# EAGLE schematic Backplane_Reference (EAGLE 6.6.0)
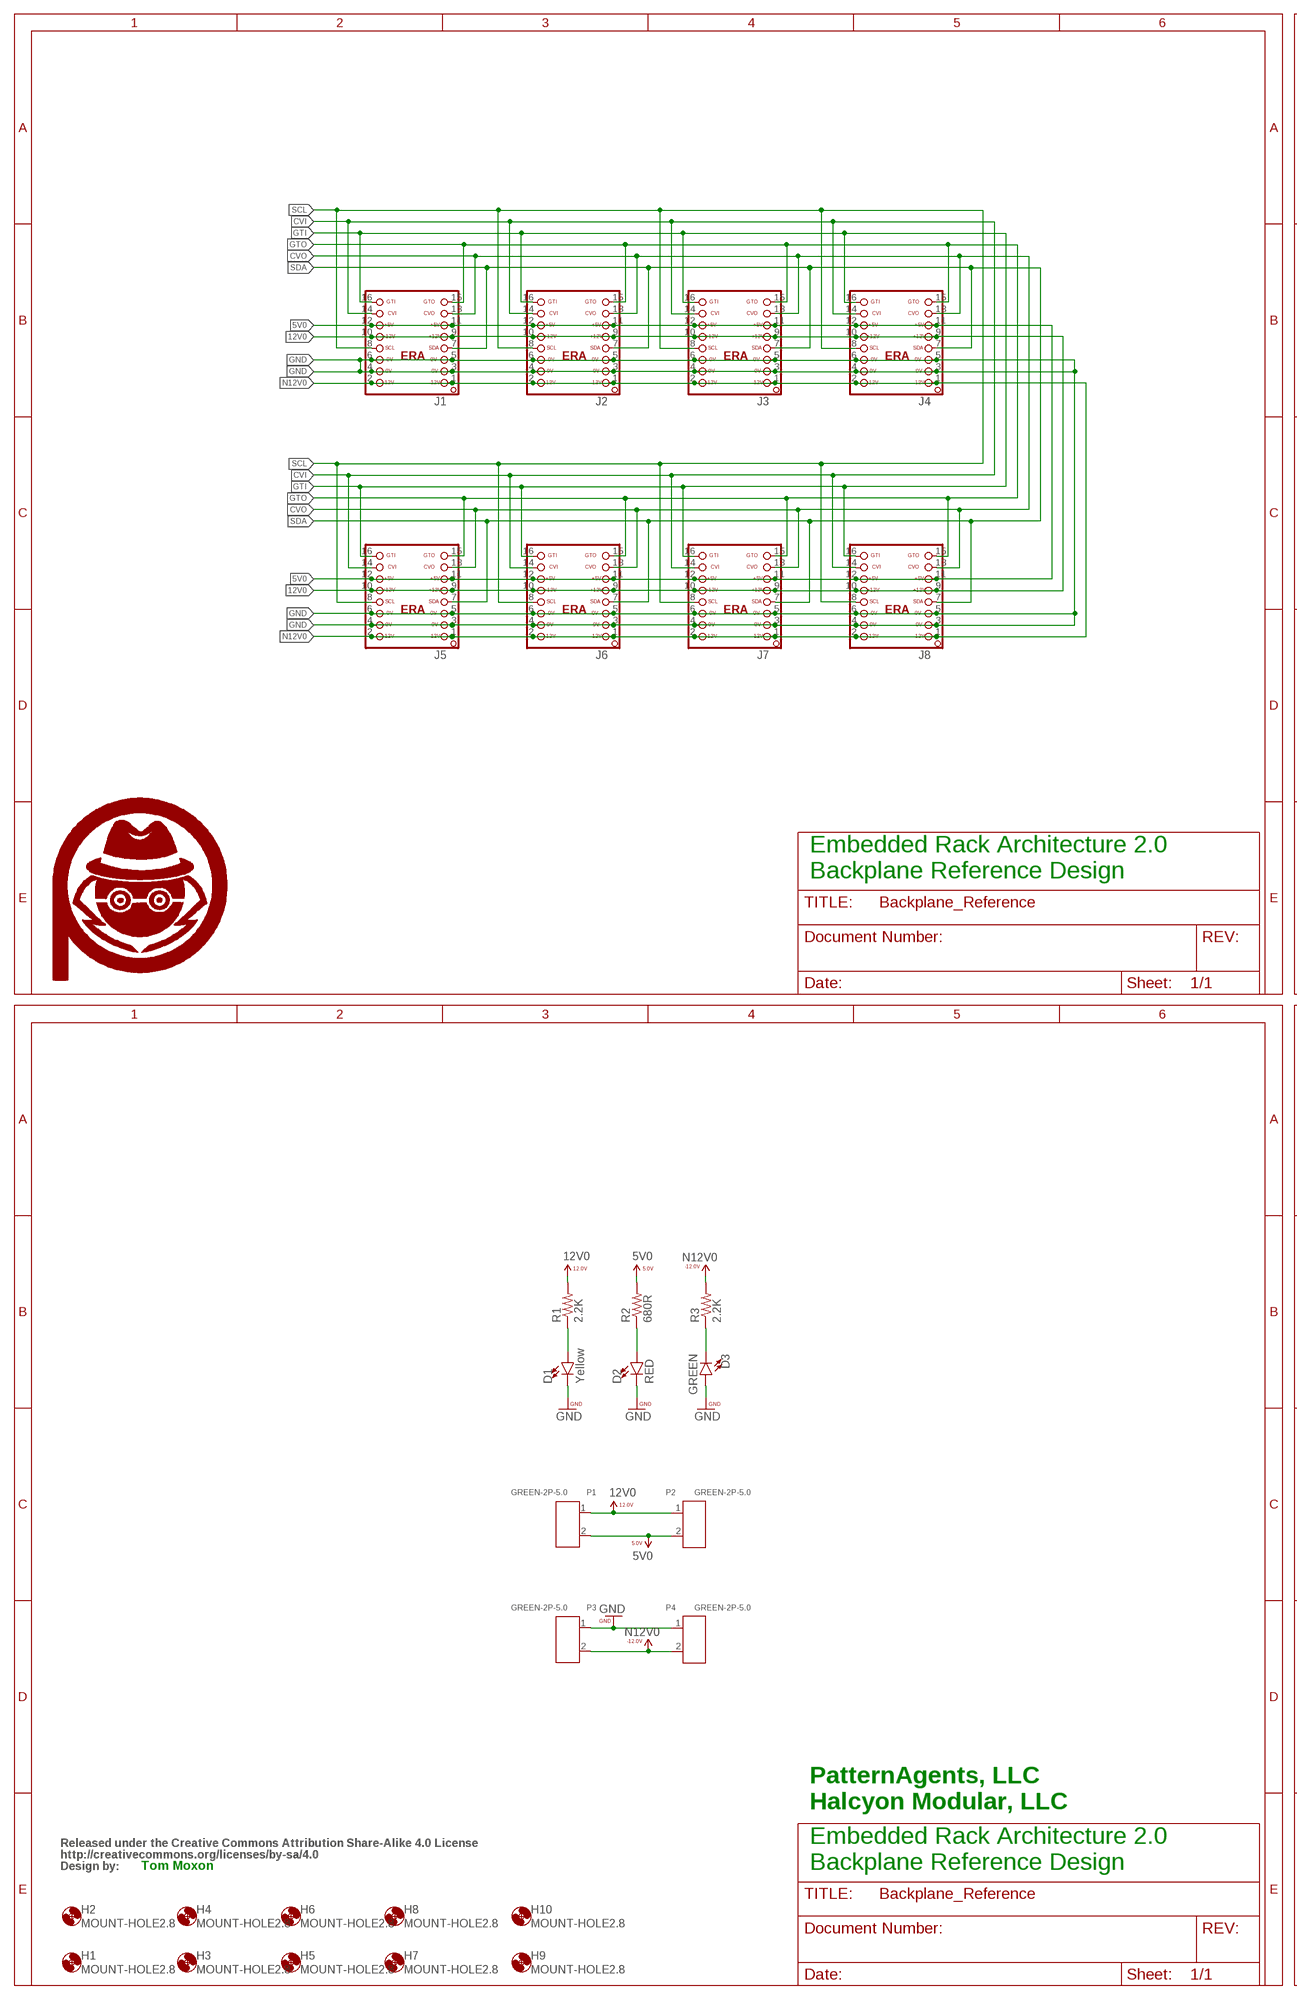
[diagram p0: schematic, sheet 1, part 1 of 2]
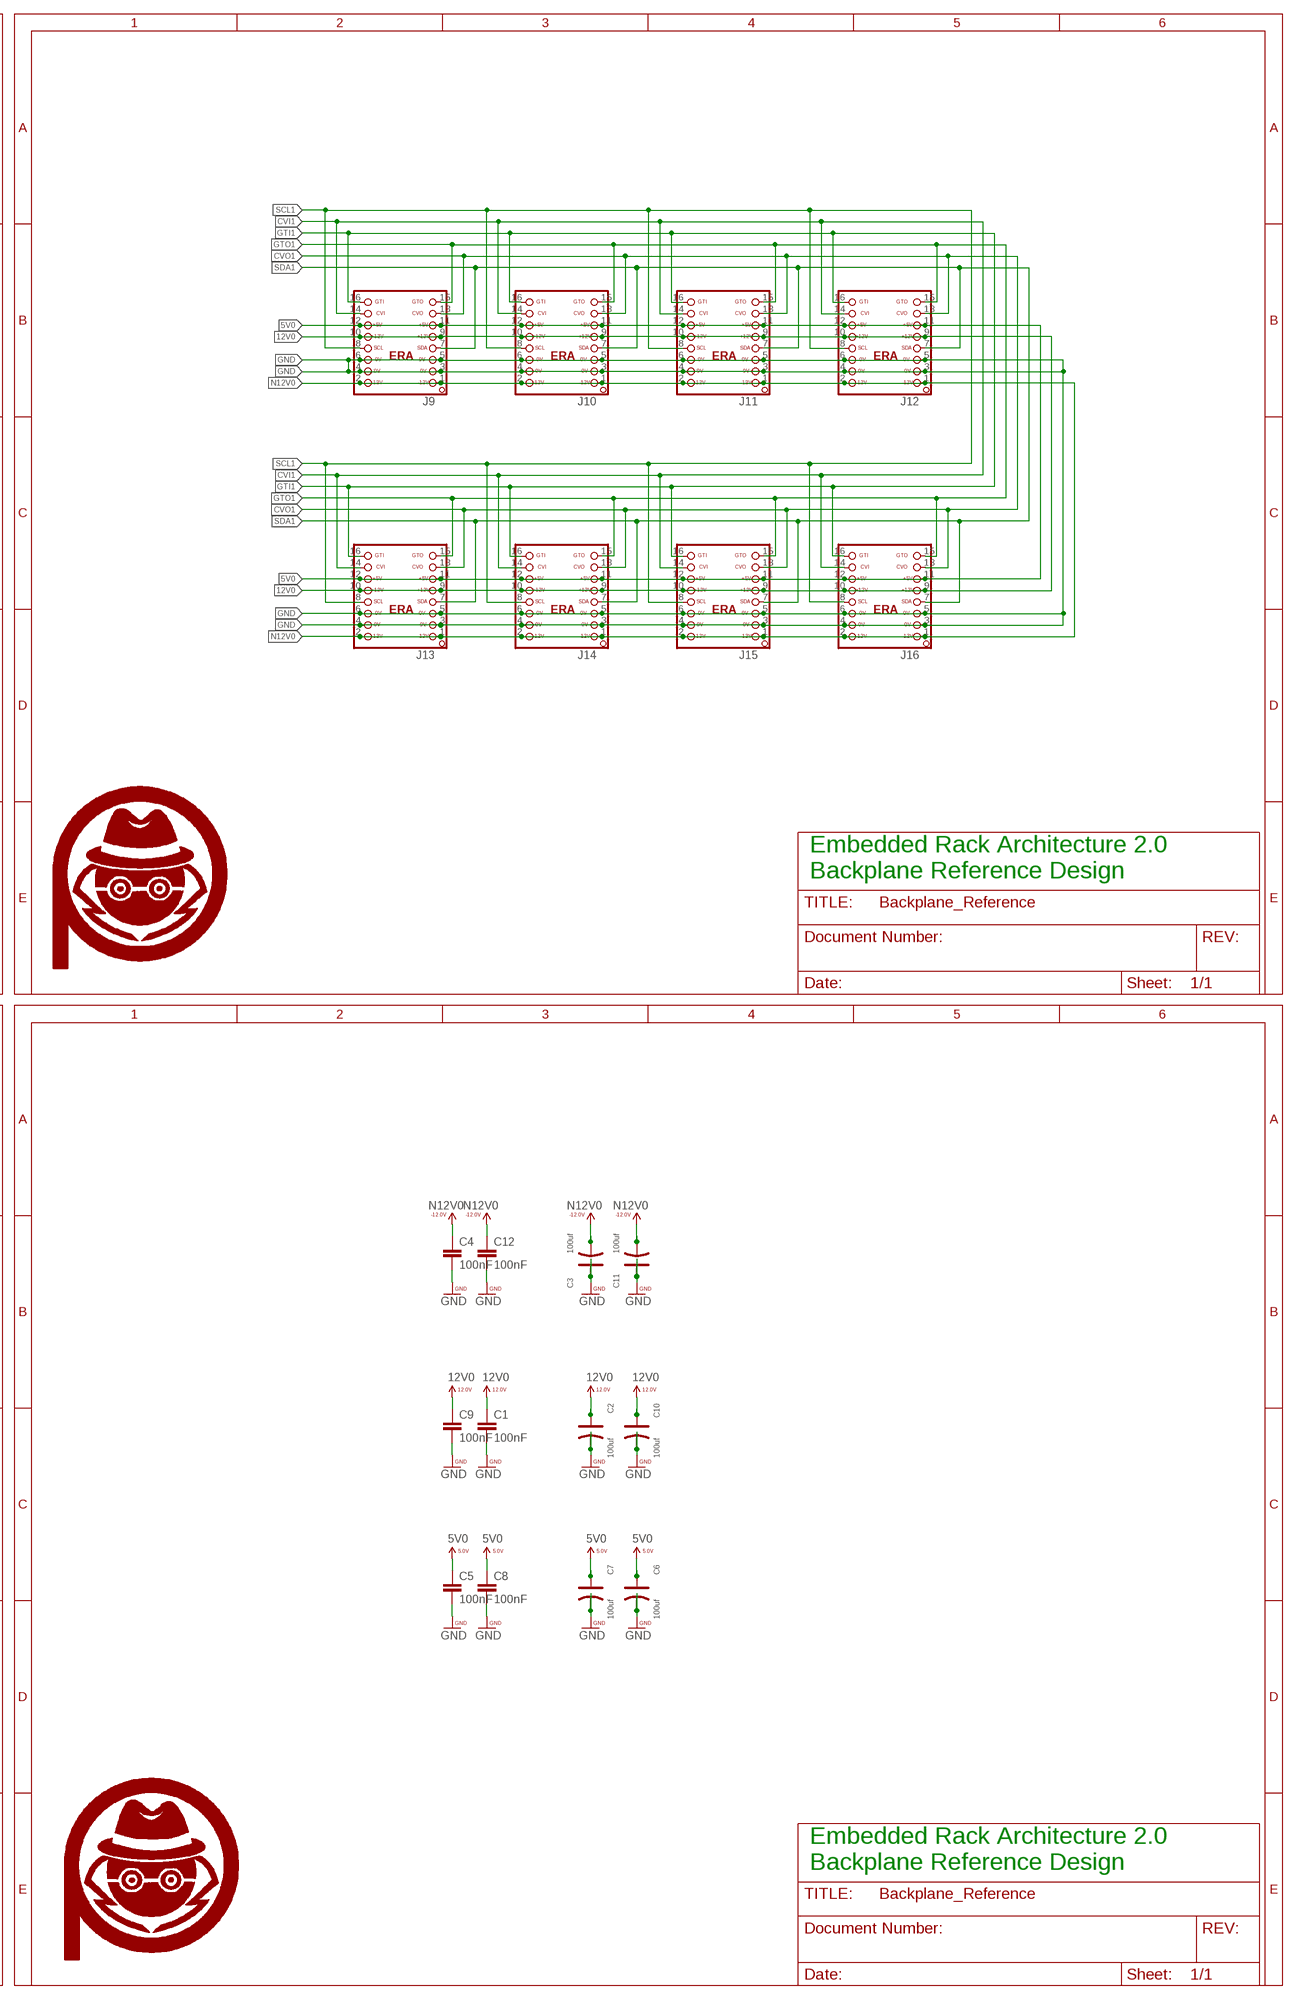
[diagram p1: schematic, sheet 1, part 2 of 2]

## Parts
C1  100nF  CAP0603-CAP  [0603-CAP]
C2  100uf  DIP-ALUMINUM-100UF-16V(D5-H7MM)  [PC-D5.3MM]
C3  100uf  DIP-ALUMINUM-100UF-16V(D5-H7MM)  [PC-D5.3MM]
C4  100nF  CAP0603-CAP  [0603-CAP]
C5  100nF  CAP0603-CAP  [0603-CAP]
C6  100uf  DIP-ALUMINUM-100UF-16V(D5-H7MM)  [PC-D5.3MM]
C7  100uf  DIP-ALUMINUM-100UF-16V(D5-H7MM)  [PC-D5.3MM]
C8  100nF  CAP0603-CAP  [0603-CAP]
C9  100nF  CAP0603-CAP  [0603-CAP]
C10  100uf  DIP-ALUMINUM-100UF-16V(D5-H7MM)  [PC-D5.3MM]
C11  100uf  DIP-ALUMINUM-100UF-16V(D5-H7MM)  [PC-D5.3MM]
C12  100nF  CAP0603-CAP  [0603-CAP]
D1  Yellow  LED-YELLOW0603  [LED-0603]
D2  RED  LED-RED0603  [LED-0603]
D3  GREEN  LED-GREEN0603  [LED-0603]
H1  MOUNT-HOLE2.8  [2,8]
H2  MOUNT-HOLE2.8  [2,8]
H3  MOUNT-HOLE2.8  [2,8]
H4  MOUNT-HOLE2.8  [2,8]
H5  MOUNT-HOLE2.8  [2,8]
H6  MOUNT-HOLE2.8  [2,8]
H7  MOUNT-HOLE2.8  [2,8]
H8  MOUNT-HOLE2.8  [2,8]
H9  MOUNT-HOLE2.8  [2,8]
H10  MOUNT-HOLE2.8  [2,8]
J1  ERA-SHROUD  [ERA]
J2  ERA-SHROUD  [ERA]
J3  ERA-SHROUD  [ERA]
J4  ERA-SHROUD  [ERA]
J5  ERA-SHROUD  [ERA]
J6  ERA-SHROUD  [ERA]
J7  ERA-SHROUD  [ERA]
J8  ERA-SHROUD  [ERA]
J9  ERA-SHROUD  [ERA]
J10  ERA-SHROUD  [ERA]
J11  ERA-SHROUD  [ERA]
J12  ERA-SHROUD  [ERA]
J13  ERA-SHROUD  [ERA]
J14  ERA-SHROUD  [ERA]
J15  ERA-SHROUD  [ERA]
J16  ERA-SHROUD  [ERA]
P1  GREEN-2P-5.0  SCREW-TERMINAL-GREEN(2P-5.0)  [H2-5.0-10.5X8.0MM]
P2  GREEN-2P-5.0  SCREW-TERMINAL-GREEN(2P-5.0)  [H2-5.0-10.5X8.0MM]
P3  GREEN-2P-5.0  SCREW-TERMINAL-GREEN(2P-5.0)  [H2-5.0-10.5X8.0MM]
P4  GREEN-2P-5.0  SCREW-TERMINAL-GREEN(2P-5.0)  [H2-5.0-10.5X8.0MM]
R1  2.2K  RESISTOR0603  [0603-RES]
R2  680R  RESISTOR0603  [0603-RES]
R3  2.2K  RESISTOR0603  [0603-RES]
U$19  PA_LOGO_SYMMED  [PA_LOGO_AGENT_MED_SYM]
U$37  PA_LOGO_SYMMED  [PA_LOGO_AGENT_MED_SYM]
U$38  PA_LOGO_SYMLARGE  [PA_LOGO_AGENT_LRG_SYM]
U$48  BY_CC_SA_TEXTTEXT  [BY_CC_SA_TEXT]

## Nets
5V0: C5.1 C6.+ C7.+ C8.1 J1.11 J1.12 J2.11 J2.12 J3.11 J3.12 J4.11 J4.12 J5.11 J5.12 J6.11 J6.12 J7.11 J7.12 J8.11 J8.12 J9.11 J9.12 J10.11 J10.12 J11.11 J11.12 J12.11 J12.12 J13.11 J13.12 J14.11 J14.12 J15.11 J15.12 J16.11 J16.12 P1.2 P2.2 R2.2
12V0: C1.1 C2.+ C9.1 C10.+ J1.9 J1.10 J2.9 J2.10 J3.9 J3.10 J4.9 J4.10 J5.9 J5.10 J6.9 J6.10 J7.9 J7.10 J8.9 J8.10 J9.9 J9.10 J10.9 J10.10 J11.9 J11.10 J12.9 J12.10 J13.9 J13.10 J14.9 J14.10 J15.9 J15.10 J16.9 J16.10 P1.1 P2.1 R1.2
CVI: J1.14 J2.14 J3.14 J4.14 J5.14 J6.14 J7.14 J8.14
CVI1: J9.14 J10.14 J11.14 J12.14 J13.14 J14.14 J15.14 J16.14
CVO: J1.13 J2.13 J3.13 J4.13 J5.13 J6.13 J7.13 J8.13
CVO1: J9.13 J10.13 J11.13 J12.13 J13.13 J14.13 J15.13 J16.13
GND: C1.2 C2.- C3.+ C4.2 C5.2 C6.- C7.- C8.2 C9.2 C10.- C11.+ C12.2 D1.C D2.C D3.A J1.3 J1.4 J1.5 J1.6 J2.3 J2.4 J2.5 J2.6 J3.3 J3.4 J3.5 J3.6 J4.3 J4.4 J4.5 J4.6 J5.3 J5.4 J5.5 J5.6 J6.3 J6.4 J6.5 J6.6 J7.3 J7.4 J7.5 J7.6 J8.3 J8.4 J8.5 J8.6 J9.3 J9.4 J9.5 J9.6 J10.3 J10.4 J10.5 J10.6 J11.3 J11.4 J11.5 J11.6 J12.3 J12.4 J12.5 J12.6 J13.3 J13.4 J13.5 J13.6 J14.3 J14.4 J14.5 J14.6 J15.3 J15.4 J15.5 J15.6 J16.3 J16.4 J16.5 J16.6 P3.1 P4.1
GREEN: D3.C R3.1
GTI: J1.16 J2.16 J3.16 J4.16 J5.16 J6.16 J7.16 J8.16
GTI1: J9.16 J10.16 J11.16 J12.16 J13.16 J14.16 J15.16 J16.16
GTO: J1.15 J2.15 J3.15 J4.15 J5.15 J6.15 J7.15 J8.15
GTO1: J9.15 J10.15 J11.15 J12.15 J13.15 J14.15 J15.15 J16.15
N12V0: C3.- C4.1 C11.- C12.1 J1.1 J1.2 J2.1 J2.2 J3.1 J3.2 J4.1 J4.2 J5.1 J5.2 J6.1 J6.2 J7.1 J7.2 J8.1 J8.2 J9.1 J9.2 J10.1 J10.2 J11.1 J11.2 J12.1 J12.2 J13.1 J13.2 J14.1 J14.2 J15.1 J15.2 J16.1 J16.2 P3.2 P4.2 R3.2
RED: D2.A R2.1
SCL: J1.8 J2.8 J3.8 J4.8 J5.8 J6.8 J7.8 J8.8
SCL1: J9.8 J10.8 J11.8 J12.8 J13.8 J14.8 J15.8 J16.8
SDA: J1.7 J2.7 J3.7 J4.7 J5.7 J6.7 J7.7 J8.7
SDA1: J9.7 J10.7 J11.7 J12.7 J13.7 J14.7 J15.7 J16.7
YELLOW: D1.A R1.1

## Notes on the sheet
- Embedded Rack Architecture 2.0
  Backplane Reference Design
- Embedded Rack Architecture 2.0
  Backplane Reference Design
- PatternAgents, LLC
  Halcyon Modular, LLC
- Tom Moxon
- Embedded Rack Architecture 2.0
  Backplane Reference Design
- Embedded Rack Architecture 2.0
  Backplane Reference Design

## Library data of the parts
C1 C4 C5 C8 C9 C12 = PatternAgents-ProtoPads:CAP: Capacitor Standard 0603 ceramic capacitor, and 0.1" leaded capacitor.
C2 C3 C6 C7 C10 C11 = Seeed-Capacitor-2016:DIP-ALUMINUM-100UF-16V(D5-H7MM): 302030031; MPN: KS 100uF/16V
D1 = SparkFun-LED:LED-YELLOW: Yellow SMD LED Used in manufacturing several products at SparkFun. Packages: 0603 - SMD 0603 package[Product Link] <http://www.kingbrightusa.com/product.asp?catalog_name=LED&product_id=APT1608SYCK> 0603 -SMART - SMART SMD 0603 package (more efficient/more expensive) [Product Link] <http://www.osram-os.com/osram_os/en/products/product-catalog/led-light-emitting-diodes/smartled-0603/ly-l29k/index.jsp> LilyPad - SMD1206 package[Product Datasheet] <https://www.sparkfun.com/datasheets/DevTools/LilyPad/Q150YUS4.pdf> SparkFun Products: Blynk Board <https://www.sparkfun.com/products/13794> IOIO-OTG <https://www.sparkfun.com/products/13613> XBee Explorer Serial <https://www.sparkfun.com/products/13225>; PROD_ID: DIO-09003
D2 = SparkFun-LED:LED-RED: Red SMD LED Used in manufacturing of most products at SparkFun Packages: 0603 - SMD 0603 package [Product Link] <http://docs.avagotech.com/docs/AV02-0551EN> 0603 SMART - SMD 0603 SMART package ( more efficient and expensive)[Product Link] <http://www.osram-os.com/Graphics/XPic2/00077099_0.pdf> 1206 - SMD1206 package [Product Link] <https://www.sparkfun.com/datasheets/DevTools/LilyPad/Q150OVS4.pdff> SparkFun Products: Pro Mini 328 -5V <https://www.sparkfun.com/products/821> RedBoard <https://www.sparkfun.com/products/12757> IOIO-OTG <https://www.sparkfun.com/products/13613>; PROD_ID: DIO-00819
D3 = SparkFun-LED:LED-GREEN: Green SMD LED Used in manufacturing of various products at SparkFun Packages: 0603 - SMD 0603 package [Product Link] <http://www.futureelectronics.com/en/technologies/semiconductors/optoelectronics/leds/Pages/9894312-LTST-C190GKT.aspx?CrossPart=HSMG-C190&IM=0> LilyPad 1206 - SMD1206 LilyPad package [Product Link] <http://www.futureelectronics.com/en/Technologies/Product.aspx?ProductID=IN150NGHARVATEKCORPORATION2049943&IM=0> 1206 - SMD1206 package [Product Link] <http://www.futureelectronics.com/en/technologies/semiconductors/optoelectronics/leds/Pages/8315665-LTST-C150KGKT.aspx?IM=0> 1206 Bottom Mount -SMD 1206 Bottom Mount [Product Link] <http://www.digikey.com/product-detail/en/lite-on-inc/LTST-C230KGKT/160-1456-1-ND/386854> SparkFun Products: Pro Mini 328 -5V <https://www.sparkfun.com/products/821> RedBoard <https://www.sparkfun.com/products/12757> MP3 Trigger <https://www.sparkfun.com/products/13720> Makey Makey <https://www.sparkfun.com/products/11076>; PROD_ID: DIO-00821
H1-H10 = euro_rack:MOUNT-HOLE: MOUNTING HOLE with drill center marker
J1-J16 = ERA:ERA: EuroRack2 - Backplane Connector
P1-P4 = Seeed-Connector -2016:SCREW-TERMINAL-GREEN(2P-5.0): 320110031
R1-R3 = halcyonmod_Passives:RESISTOR: Resistor Basic schematic elements and footprints for 0603, 1206, and PTH resistors.
U$19 U$37 U$38 = PatternAgents-Logos:PA_LOGO_SYM: PatternAgents Logo Symbol Trademark : PatternAgents, LLC Github : https://github.com/PatternAgents/PCB_Libraries License : http://creativecommons.org/licenses/by-sa/3.0/ (Creative Commons 3.0) THIS SOFTWARE IS PROVIDED BY THE CONTRIBUTORS "AS IS" AND WITHOUT ANY EXPRESS OR IMPLIED WARRANTIES, INCLUDING, BUT NOT LIMITED TO, THE IMPLIED WARRANTIES OF MERCHANTABILITY AND FITNESS FOR A PARTICULAR PURPOSE ARE DISCLAIMED. IN NO EVENT SHALL THE COPYRIGHT OWNER OR CONTRIBUTORS BE LIABLE FOR ANY DIRECT, INDIRECT, INCIDENTAL, SPECIAL, EXEMPLARY, OR CONSEQUENTIAL DAMAGES (INCLUDING, BUT NOT LIMITED TO, PROCUREMENT OF SUBSTITUTE GOODS OR SERVICES; LOSS OF USE, DATA, OR PROFITS; OR BUSINESS INTERRUPTION) HOWEVER CAUSED AND ON ANY THEORY OF LIABILITY, WHETHER IN CONTRACT, STRICT LIABILITY, OR TORT (INCLUDING NEGLIGENCE OR OTHERWISE) ARISING IN ANY WAY OUT OF THE USE OF THIS SOFTWARE, EVEN IF ADVISED OF THE POSSIBILITY OF SUCH DAMAGE.
U$48 = PatternAgents-Logos:BY_CC_SA_TEXT: BY_CC_SA_TEXT Source : http://wiki.creativecommons.org/CC_markers Github : https://github.com/PatternAgents/PCB_Libraries License : http://creativecommons.org/licenses/by-sa/4.0/ (Creative Commons 4.0) THIS SOFTWARE IS PROVIDED BY THE CONTRIBUTORS "AS IS" AND WITHOUT ANY EXPRESS OR IMPLIED WARRANTIES, INCLUDING, BUT NOT LIMITED TO, THE IMPLIED WARRANTIES OF MERCHANTABILITY AND FITNESS FOR A PARTICULAR PURPOSE ARE DISCLAIMED. IN NO EVENT SHALL THE COPYRIGHT OWNER OR CONTRIBUTORS BE LIABLE FOR ANY DIRECT, INDIRECT, INCIDENTAL, SPECIAL, EXEMPLARY, OR CONSEQUENTIAL DAMAGES (INCLUDING, BUT NOT LIMITED TO, PROCUREMENT OF SUBSTITUTE GOODS OR SERVICES; LOSS OF USE, DATA, OR PROFITS; OR BUSINESS INTERRUPTION) HOWEVER CAUSED AND ON ANY THEORY OF LIABILITY, WHETHER IN CONTRACT, STRICT LIABILITY, OR TORT (INCLUDING NEGLIGENCE OR OTHERWISE) ARISING IN ANY WAY OUT OF THE USE OF THIS SOFTWARE, EVEN IF ADVISED OF THE POSSIBILITY OF SUCH DAMAGE.